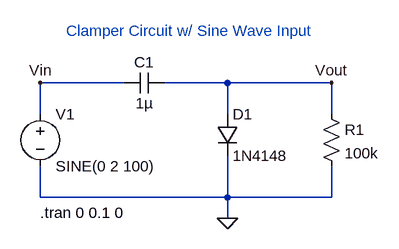
[diagram p0: schematic 2EEB_VELASCO_EXPT4_CKT4.asc]
2EEB_VELASCO_EXPT4_CKT4.asc, the LTspice schematic file:
Version 4
SHEET 1 880 680
WIRE 224 48 96 48
WIRE 384 48 288 48
WIRE 544 48 384 48
WIRE 96 96 96 48
WIRE 384 96 384 48
WIRE 544 96 544 48
WIRE 96 224 96 176
WIRE 384 224 384 160
WIRE 384 224 96 224
WIRE 544 224 544 176
WIRE 544 224 384 224
WIRE 384 256 384 224
FLAG 384 256 0
FLAG 544 48 Vout
FLAG 96 48 Vin
SYMBOL voltage 96 80 R0
SYMATTR InstName V1
SYMATTR Value SINE(0 2 100)
SYMBOL cap 288 32 R90
WINDOW 0 0 32 VBottom 2
WINDOW 3 32 32 VTop 2
SYMATTR InstName C1
SYMATTR Value 1µ
SYMBOL diode 368 96 R0
SYMATTR InstName D1
SYMATTR Value 1N4148
SYMBOL res 528 80 R0
SYMATTR InstName R1
SYMATTR Value 100k
TEXT 96 248 Left 2 !.tran 0 0.1 0
TEXT 136 -32 Left 2 ;Clamper Circuit w/ Sine Wave Input

The netlist it stands for:
* 2EEB_VELASCO_EXPT4_CKT4.asc
V1 Vin 0 SINE(0 2 100)
C1 Vout Vin 1µ
D1 Vout 0 1N4148
R1 Vout 0 100k
.model D D
.lib standard.dio
.tran 0 0.1 0
* Clamper Circuit w/ Sine Wave Input
.backanno
.end